# EasyEDA schematic schematics.json
TITLE: 2040; REV: 1.0; Date: 2024-05-11; Sheet: 1/1; Drawn By: deepnandi
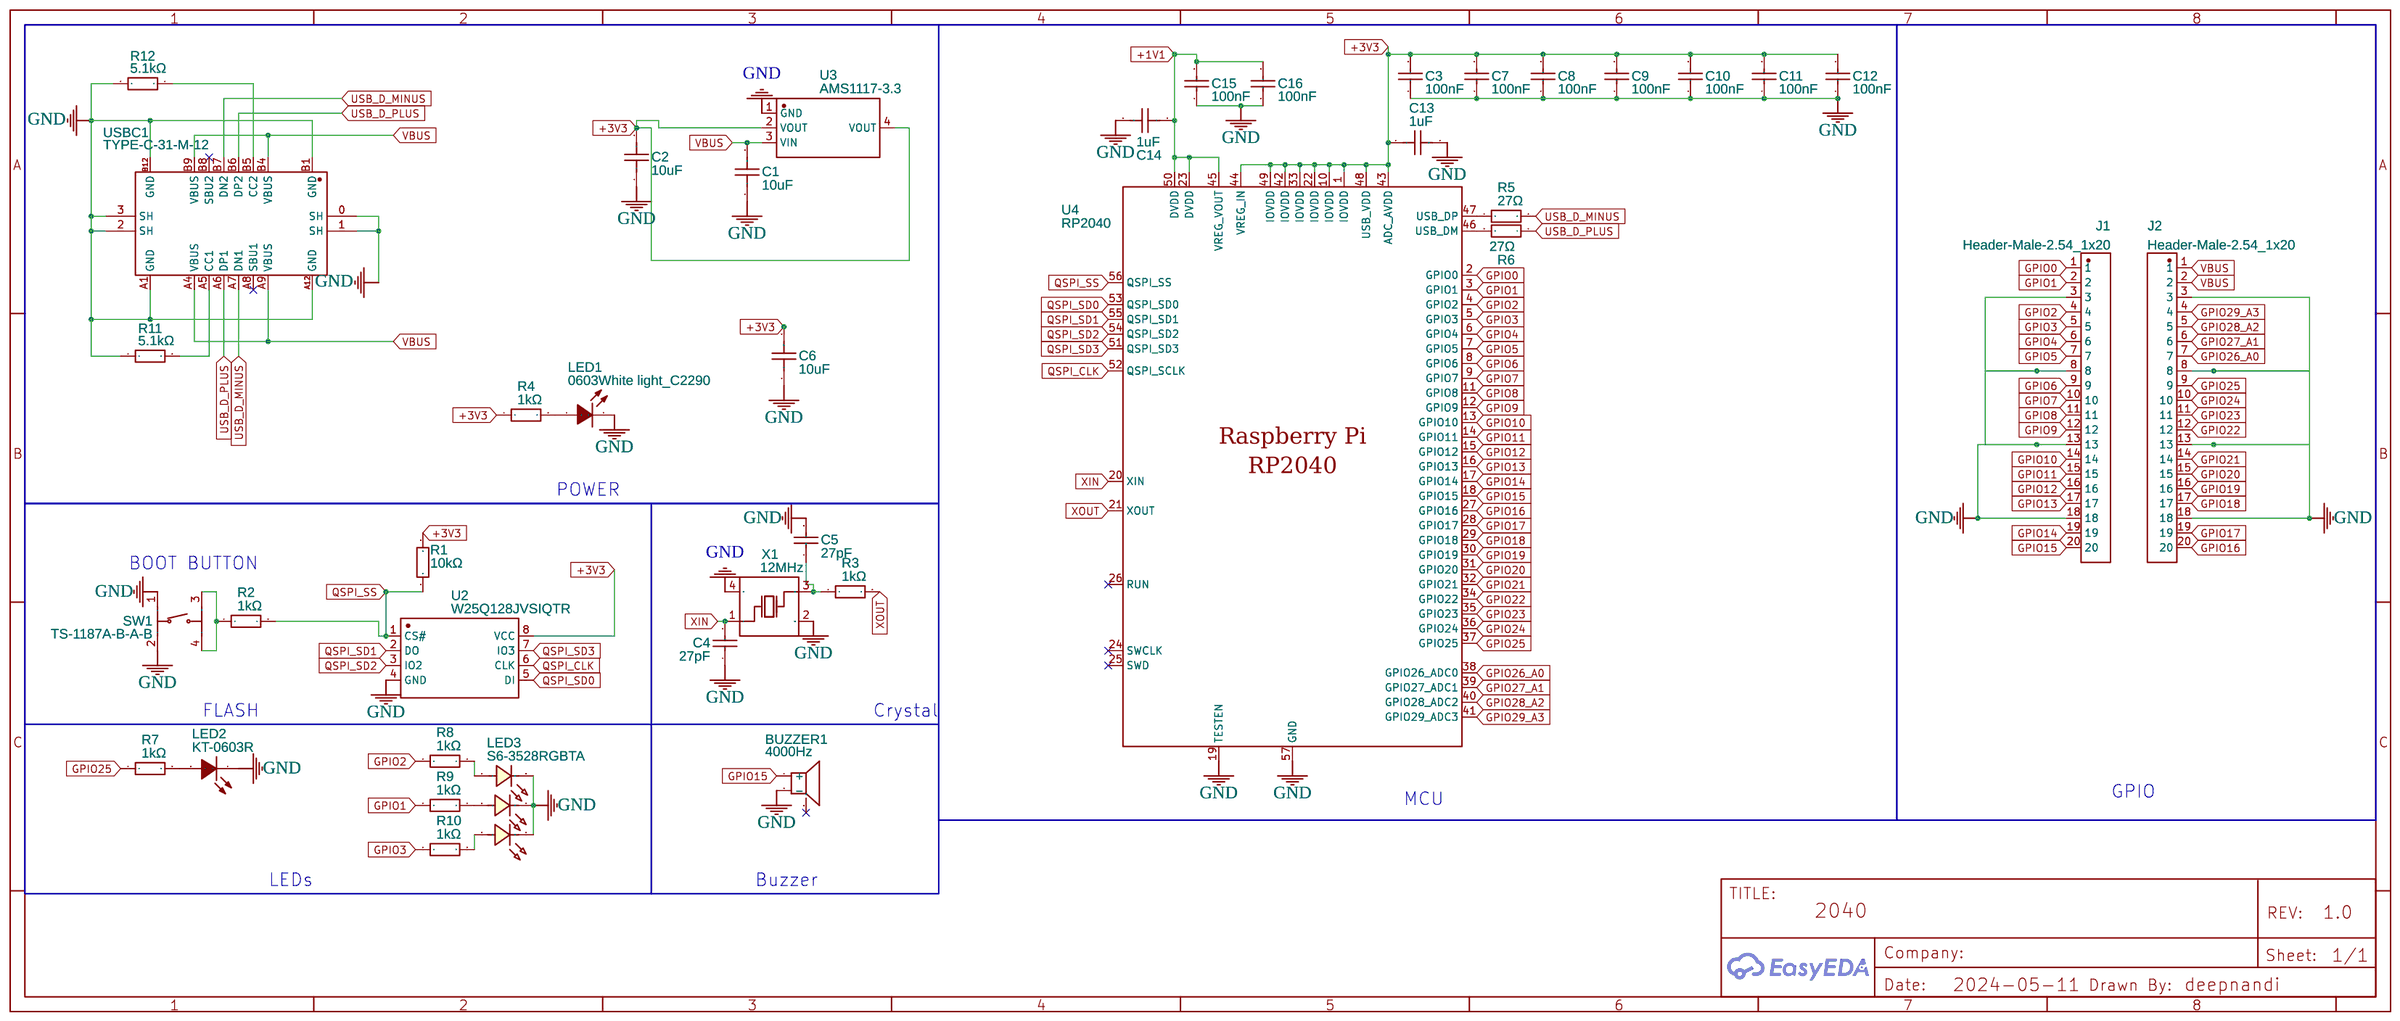
[diagram p0: schematic sheet]

## Parts
BUZZER1  4000Hz  [BUZ-SMD_L5.0-W5.5-P4.60]
C1  10uF  [C0603]
C2  10uF  [C0603]
C3  100nF  [C0402]
C4  27pF  [C0603]
C5  27pF  [C0603]
C6  10uF  [C0603]
C7  100nF  [C0402]
C8  100nF  [C0402]
C9  100nF  [C0402]
C10  100nF  [C0402]
C11  100nF  [C0402]
C12  100nF  [C0402]
C13  1uF  [C0402]
C14  1uF  [C0402]
C15  100nF  [C0402]
C16  100nF  [C0402]
J1  Header-Male-2.54_1x20  [HDR-TH_20P-P2.54-V-M-1]
J2  Header-Male-2.54_1x20  [HDR-TH_20P-P2.54-V-M-1]
LED1  0603White light_C2290  [LED0603-R-RD_WHITE]
LED2  KT-0603R  [LED0603-RD]
LED3  S6-3528RGBTA  [LED-SMD-6P_S6-3528RGBTA]
R1  10kΩ  [R0402]
R2  1kΩ  [R0402]
R3  1kΩ  [R0402]
R4  1kΩ  [R0402]
R5  27Ω  [R0805]
R6  27Ω  [R0805]
R7  1kΩ  [R0402]
R8  1kΩ  [R0402]
R9  1kΩ  [R0402]
R10  1kΩ  [R0402]
R11  5.1kΩ  [R0402]
R12  5.1kΩ  [R0402]
SW1  TS-1187A-B-A-B  [SW-SMD_4P-L5.1-W5.1-P3.70-LS6.5-TL-2]
U2  W25Q128JVSIQTR  [SOIC-8_L5.3-W5.3-P1.27-LS8.0-BL]
U3  AMS1117-3.3  [SOT-223-3_L6.5-W3.4-P2.30-LS7.0-BR]
U4  RP2040  [LQFN-56_L7.0-W7.0-P0.4-EP]
USBC1  TYPE-C-31-M-12  [USB-C_SMD-TYPE-C-31-M-12]
X1  12MHz  [OSC-SMD_4P-L3.2-W2.5-BL]

## Library data of the parts
BUZZER1 = MLT-5020: Supplier: LCSC; Manufacturer: 华能; Supplier Part: C94598; JLCPCB Part Class: Extended Part
C1 C2 C6 = CL10A106KP8NNNC: Supplier: LCSC; Manufacturer: SAMSUNG(三星); Supplier Part: C19702; JLCPCB Part Class: Basic Part
C3 C7-C12 C15 C16 = CL05B104KO5NNNC: Supplier: LCSC; Manufacturer: SAMSUNG(三星); Supplier Part: C1525; JLCPCB Part Class: Basic Part
C4 C5 = CC0603JRNPO9BN270: Supplier: LCSC; Manufacturer: YAGEO(国巨); Supplier Part: C107045; JLCPCB Part Class: Extended Part
C13 C14 = CL05A105KA5NQNC: Supplier: LCSC; Manufacturer: SAMSUNG(三星); Supplier Part: C52923; JLCPCB Part Class: Basic Part
J1 J2 = Header-Male-2.54_1x20: Supplier: LCSC; Manufacturer: BOOMELE(博穆精密); Manufacturer Part: 2.54-1*20P直针; Supplier Part: C50981; JLCPCB Part Class: Extended Part
LED1 = 0603White light_C2290: Supplier: LCSC; Manufacturer: KENTO; Manufacturer Part: KT-0603白灯; Supplier Part: C2290; JLCPCB Part Class: Basic Part
LED2 = KT-0603R: Supplier: LCSC; Manufacturer: KENTO; Supplier Part: C2286; JLCPCB Part Class: Basic Part
LED3 = S6-3528RGBTA: Contributor: LCSC; Supplier: LCSC; Supplier Part: C2843672; Manufacturer: TUOZHAN(拓展光电); JLCPCB Part Class: Extended Part
R1 = 0402WGF1002TCE: Supplier: LCSC; Manufacturer: UNI-ROYAL(厚声); Supplier Part: C25744; JLCPCB Part Class: Basic Part
R2-R4 R7-R10 = 0402WGF1001TCE: Supplier: LCSC; Manufacturer: UNI-ROYAL(厚声); Supplier Part: C11702; JLCPCB Part Class: Basic Part
R5 R6 = 0805W8F270JT5E: Supplier: LCSC; Manufacturer: UNI-ROYAL(厚声); Supplier Part: C17594; JLCPCB Part Class: Extended Part
R11 R12 = RTT02512JTH: Supplier: LCSC; Manufacturer: RALEC(旺诠); Supplier Part: C103086; Resistance (Ohms): 5.1K; JLCPCB Part Class: Extended Part
SW1 = TS-1187A-B-A-B: Contributor: LCSC; Supplier: LCSC; Supplier Part: C318884; Manufacturer: XKB Connectivity(中国星坤); JLCPCB Part Class: Basic Part
U2 = W25Q128JVSIQTR: Supplier: LCSC; Manufacturer: WINBOND(华邦); Manufacturer Part: W25Q128JVSIQ; Supplier Part: C97521; JLCPCB Part Class: Basic Part
U3 = AMS1117-3.3: sourceId: dwIGgezVh; Supplier: LCSC; Manufacturer: AMS; Supplier Part: C6186; JLCPCB Part Class: Basic Part
U4 = RP2040: Contributor: LCSC; Supplier: LCSC; Supplier Part: C2040; Manufacturer: Raspberry Pi(树莓派); JLCPCB Part Class: Extended Part
USBC1 = TYPE-C-31-M-12: Supplier: LCSC; Supplier Part: C165948; Manufacturer: 韩国韩荣; Contributor: LCSC; JLCPCB Part Class: Extended Part
X1 = X322512MSB4SI: Supplier: LCSC; Manufacturer: YXC(扬兴晶振); Supplier Part: C9002; JLCPCB Part Class: Basic Part

## Nets
+1V1: C14.2 C15.2 C16.2 U4.23(DVDD) U4.45(VREG_VOUT) U4.50(DVDD)
+3V3: C2.2 C3.2 C6.2 C7.2 C8.2 C9.2 C10.2 C11.2 C12.2 C13.1 R1.2 R4.1 U2.8(VCC) U3.2(VOUT) U3.4(VOUT) U4.1(IOVDD) U4.10(IOVDD) U4.22(IOVDD) U4.33(IOVDD) U4.42(IOVDD) U4.43(ADC_AVDD) U4.44(VREG_IN) U4.48(USB_VDD) U4.49(IOVDD)
GND: BUZZER1.2(-) C1.1 C2.1 C3.1 C4.1 C5.2 C6.1 C7.1 C8.1 C9.1 C10.1 C11.1 C12.1 C13.2 C14.1 C15.1 C16.1 J1.3 J1.8 J1.13 J1.18 J2.3 J2.8 J2.13 J2.18 LED1.2(K) LED2.1(K) LED3.1 LED3.2 LED3.3 R11.1 R12.2 SW1.1(A) SW1.2(B) U2.4(GND) U3.1(GND) U4.19(TESTEN) U4.57(GND) USBC1.0(SH) USBC1.1(SH) USBC1.2(SH) USBC1.3(SH) USBC1.A1(GND) USBC1.A12(GND) USBC1.B1(GND) USBC1.B12(GND) X1.2(GND) X1.4(GND)
VBUS: C1.2 J2.1 J2.2 U3.3(VIN) USBC1.A4(VBUS) USBC1.A9(VBUS) USBC1.B4(VBUS) USBC1.B9(VBUS)
GPIO0: J1.1 U4.2(GPIO0)
GPIO1: J1.2 R9.1 U4.3(GPIO1)
GPIO2: J1.4 R8.1 U4.4(GPIO2)
GPIO3: J1.5 R10.1 U4.5(GPIO3)
GPIO4: J1.6 U4.6(GPIO4)
GPIO5: J1.7 U4.7(GPIO5)
GPIO6: J1.9 U4.8(GPIO6)
GPIO7: J1.10 U4.9(GPIO7)
GPIO8: J1.11 U4.11(GPIO8)
GPIO9: J1.12 U4.12(GPIO9)
GPIO10: J1.14 U4.13(GPIO10)
GPIO11: J1.15 U4.14(GPIO11)
GPIO12: J1.16 U4.15(GPIO12)
GPIO13: J1.17 U4.16(GPIO13)
GPIO14: J1.19 U4.17(GPIO14)
GPIO15: BUZZER1.1(+) J1.20 U4.18(GPIO15)
GPIO16: J2.20 U4.27(GPIO16)
GPIO17: J2.19 U4.28(GPIO17)
GPIO18: J2.17 U4.29(GPIO18)
GPIO19: J2.16 U4.30(GPIO19)
GPIO20: J2.15 U4.31(GPIO20)
GPIO21: J2.14 U4.32(GPIO21)
GPIO22: J2.12 U4.34(GPIO22)
GPIO23: J2.11 U4.35(GPIO23)
GPIO24: J2.10 U4.36(GPIO24)
GPIO25: J2.9 R7.1 U4.37(GPIO25)
GPIO26_A0: J2.7 U4.38(GPIO26_ADC0)
GPIO27_A1: J2.6 U4.39(GPIO27_ADC1)
GPIO28_A2: J2.5 U4.40(GPIO28_ADC2)
GPIO29_A3: J2.4 U4.41(GPIO29_ADC3)
QSPI_CLK: U2.6(CLK) U4.52(QSPI_SCLK)
QSPI_SD0: U2.5(DI) U4.53(QSPI_SD0)
QSPI_SD1: U2.2(DO) U4.55(QSPI_SD1)
QSPI_SD2: U2.3(IO2) U4.54(QSPI_SD2)
QSPI_SD3: U2.7(IO3) U4.51(QSPI_SD3)
QSPI_SS: R1.1 R2.2 U2.1(CS#) U4.56(QSPI_SS)
USB_D_MINUS: R5.2 USBC1.A7(DN1) USBC1.B7(DN2)
USB_D_PLUS: R6.1 USBC1.A6(DP1) USBC1.B6(DP2)
XIN: C4.2 U4.20(XIN) X1.1(OSC1)
XOUT: R3.2 U4.21(XOUT)
Net-(C5-1): C5.1 R3.1 X1.3(OSC2)
Net-(LED1-1): LED1.1(A) R4.2
Net-(LED2-2): LED2.2(A) R7.2
Net-(LED3-4): LED3.4 R8.2
Net-(LED3-5): LED3.5 R9.2
Net-(LED3-6): LED3.6 R10.2
Net-(R2-1): R2.1 SW1.3(C) SW1.4(D)
Net-(R5-1): R5.1 U4.47(USB_DP)
Net-(R6-2): R6.2 U4.46(USB_DM)
Net-(R11-2): R11.2 USBC1.A5(CC1)
Net-(R12-1): R12.1 USBC1.B5(CC2)

Not connected (* = marked no-connect by the designer): BUZZER1 3(NC)*; U4 24(SWCLK)* 25(SWD)* 26(RUN)*; USBC1 A8(SBU1)* B8(SBU2)*

## Notes on the sheet
- POWER
- BOOT BUTTON
- FLASH
- Crystal
- MCU
- GPIO
- LEDs
- Buzzer
